# EAGLE design IO-module-8x_fused_in-wall_35x25 (EAGLE 9.6.2)
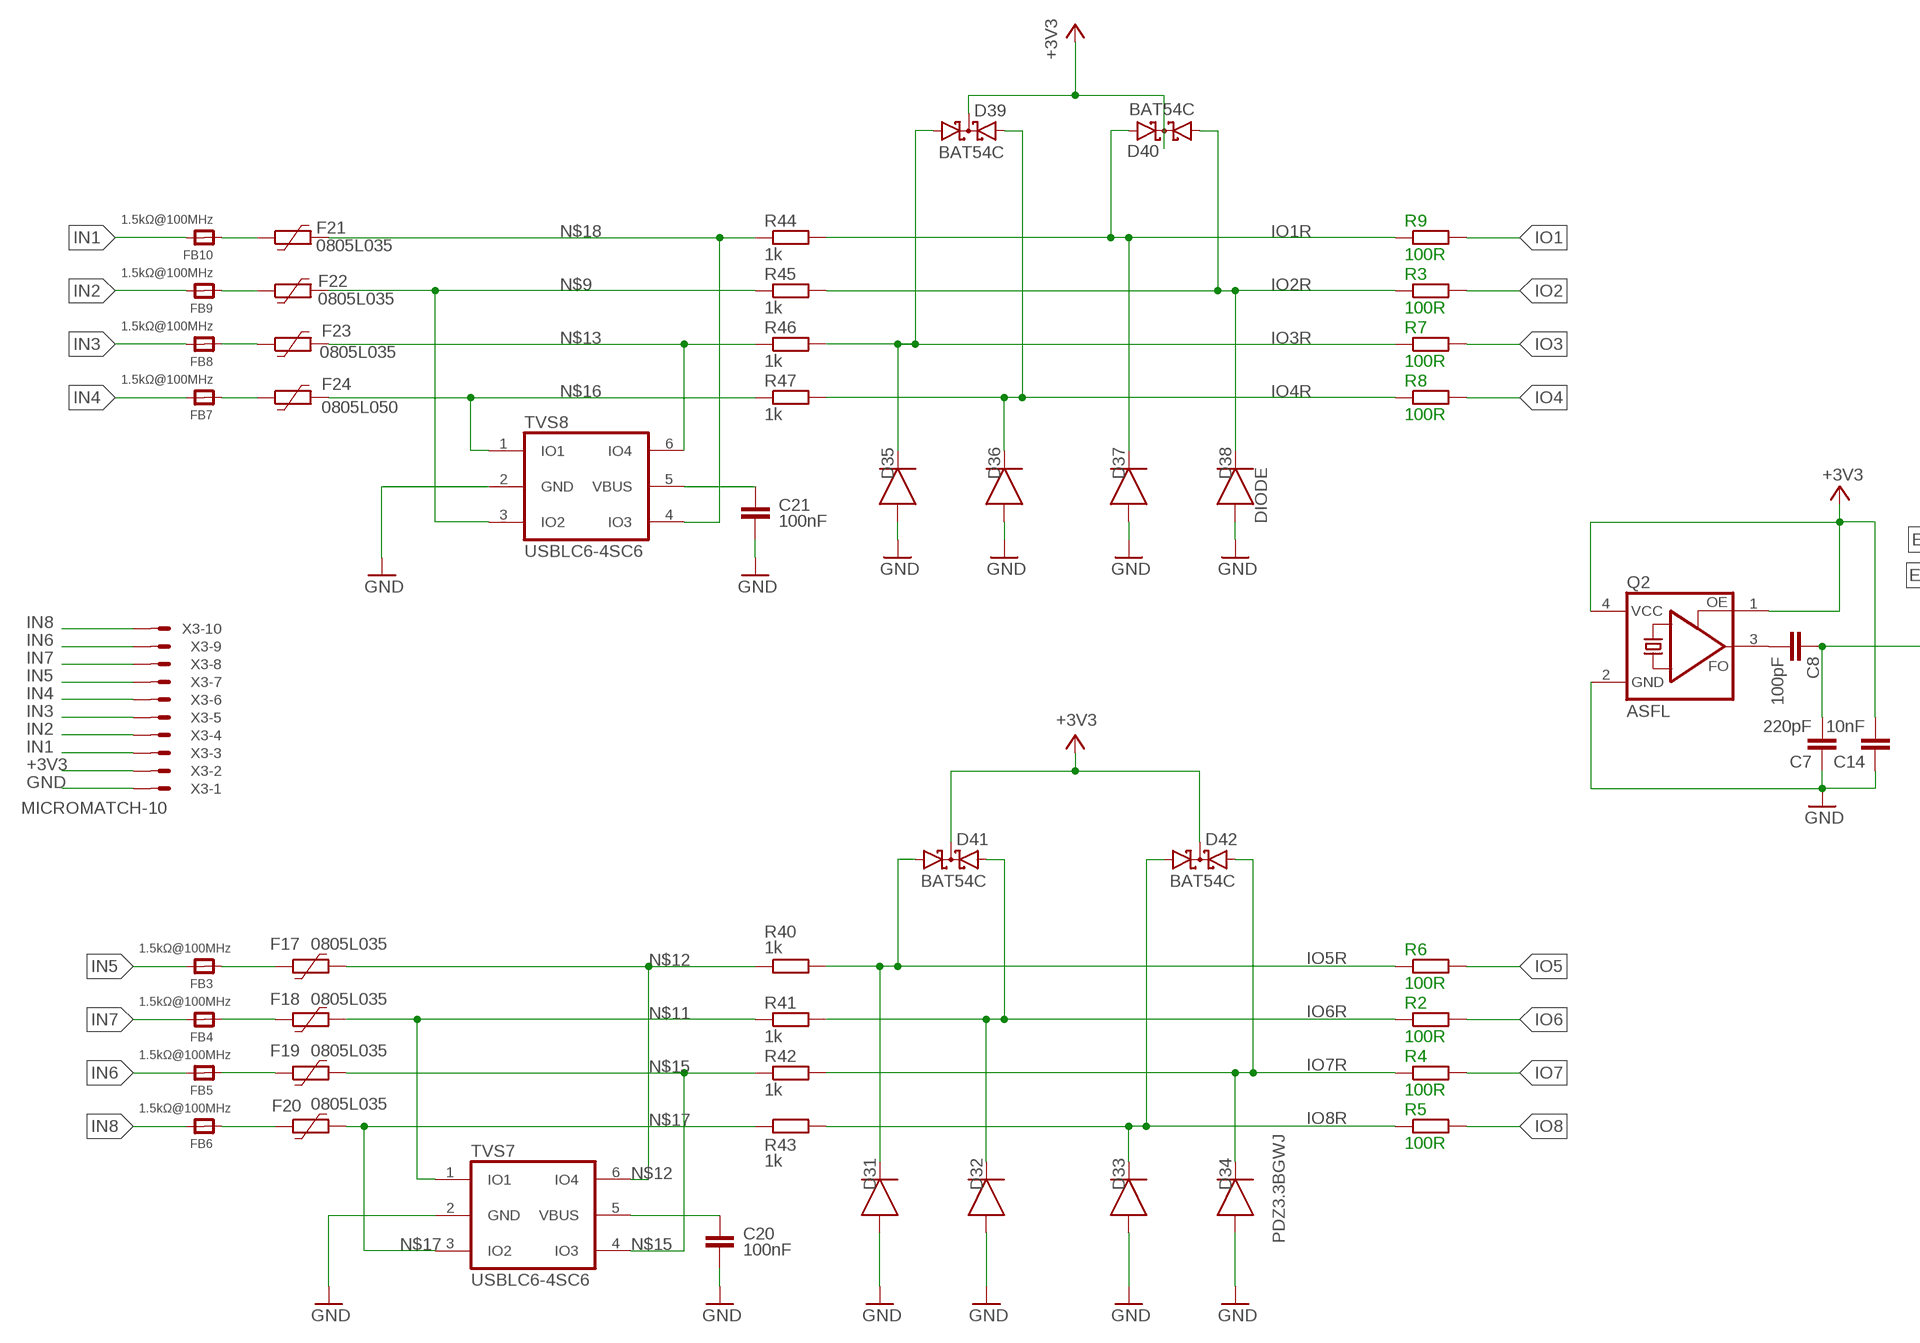
[diagram p0: schematic, sheet 1, part 1 of 2]
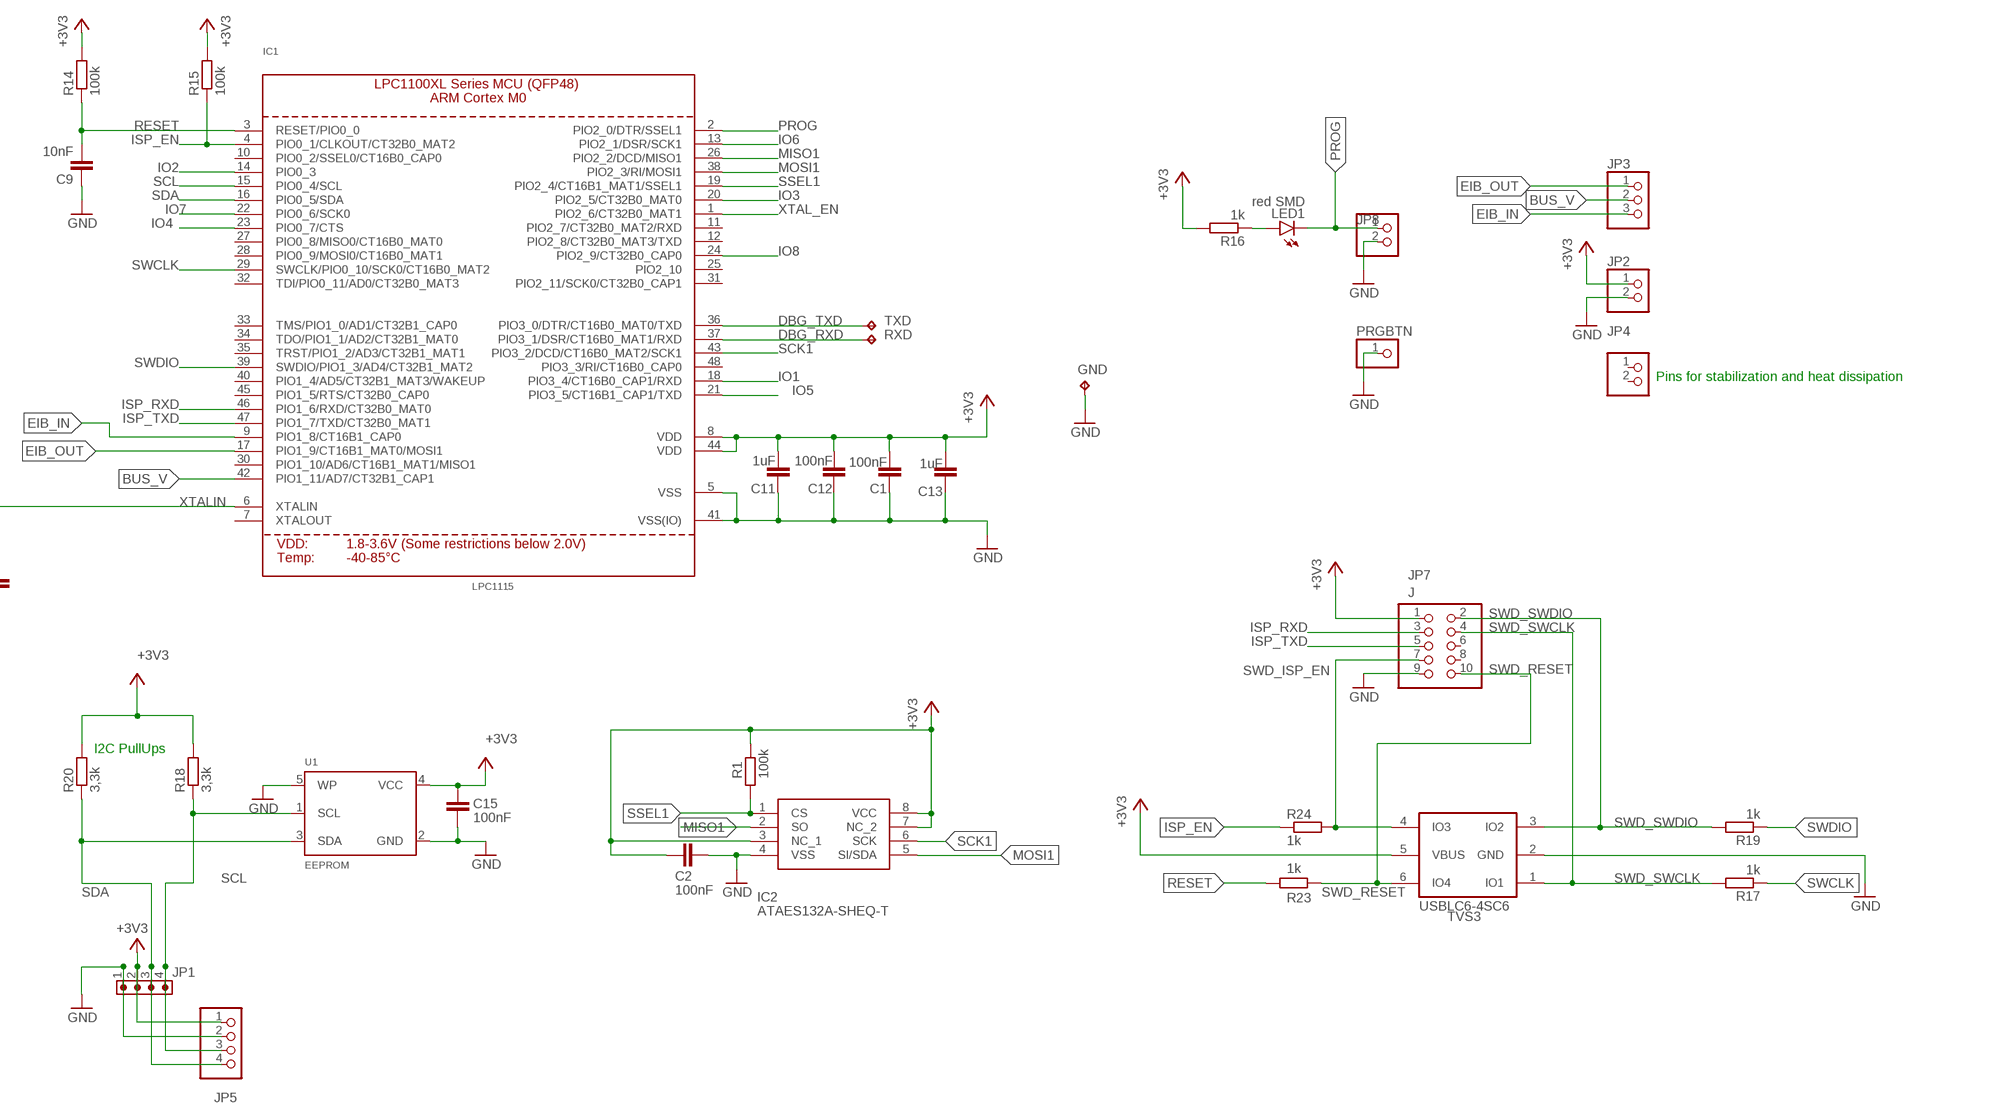
[diagram p1: schematic, sheet 1, part 2 of 2]

## Parts
C1  100nF  C-EUC0805  [C0805]
C2  100nF  C-EUC0805  [C0805]
C7  220pF  C-EUC0805  [C0805]
C8  100pF  C-EUC0805  [C0805]
C9  10nF  C-EUC0805  [C0805]
C11  1uF  C-EUC0805  [C0805]
C12  100nF  C-EUC0805  [C0805]
C13  1uF  C-EUC0805  [C0805]
C14  10nF  C-EUC0805  [C0805]
C15  100nF  C-EUC0805  [C0805]
C20  100nF  C-EUC0805  [C0805]
C21  100nF  C-EUC0805  [C0805]
D31  DDZ9684  DIODE_DO-219-AB(SOD123F)  [SODFL3718X115]
D32  DIODE  DIODE_DO-219-AB(SOD123F)  [SODFL3718X115]
D33  DIODE  DIODE_DO-219-AB(SOD123F)  [SODFL3718X115]
D34  PDZ3.3BGWJ  DIODE_DO-219-AB(SOD123F)  [SODFL3718X115]
D35  DIODE  DIODE_DO-219-AB(SOD123F)  [SODFL3718X115]
D36  DIODE  DIODE_DO-219-AB(SOD123F)  [SODFL3718X115]
D37  DIODE  DIODE_DO-219-AB(SOD123F)  [SODFL3718X115]
D38  DIODE  DIODE_DO-219-AB(SOD123F)  [SODFL3718X115]
D39  BAT54C  [SOT23]
D40  BAT54C  [SOT23]
D41  BAT54C  [SOT23]
D42  BAT54C  [SOT23]
F17  0805L035  [0805L]
F18  0805L035  [0805L]
F19  0805L035  [0805L]
F20  0805L035  [0805L]
F21  0805L035  [0805L]
F22  0805L035  [0805L]
F23  0805L035  [0805L]
F24  0805L050  [0805L]
FB3  1.5kΩ@100MHz  FERRITE0805  [0805]
FB4  1.5kΩ@100MHz  FERRITE0805  [0805]
FB5  1.5kΩ@100MHz  FERRITE0805  [0805]
FB6  1.5kΩ@100MHz  FERRITE0805  [0805]
FB7  1.5kΩ@100MHz  FERRITE0805  [0805]
FB8  1.5kΩ@100MHz  FERRITE0805  [0805]
FB9  1.5kΩ@100MHz  FERRITE0805  [0805]
FB10  1.5kΩ@100MHz  FERRITE0805  [0805]
GND  TPTP11SQ  [TP11SQ]
IC1  LPC1115  LPC1113/4/5_QFP48_XLSERIES  [LQFP48]
IC2  ATAES132A-SHEQ-T  [SOIC127P600X175-8N]
JP1  62000411622  62000411622  [62000411622]
JP2  PINHD-1X2  [1X02]
JP3  PINHD-1X3  [1X03]
JP4  PINHD-1X2  [1X02]
JP5  PINHD-1X4  [1X04]
JP7  J  PINHD-2X05_2.00  [2X05M]
JP8  PINHD-1X2  [1X02]
LED1  red SMD  LEDCHIPLED_1206  [CHIPLED_1206]
PRGBTN  PINHD-1X1  [1X01]
Q2  ASFL  [ASF]
R1  100k  R-EU_R0805  [R0805]
R2  100R  R-EU_R0805  [R0805]
R3  100R  R-EU_R0805  [R0805]
R4  100R  R-EU_R0805  [R0805]
R5  100R  R-EU_R0805  [R0805]
R6  100R  R-EU_R0805  [R0805]
R7  100R  R-EU_R0805  [R0805]
R8  100R  R-EU_R0805  [R0805]
R9  100R  R-EU_R0805  [R0805]
R14  100k  R-EU_R0805  [R0805]
R15  100k  R-EU_R0805  [R0805]
R16  1k  R-EU_R0805  [R0805]
R17  1k  R-EU_R0805  [R0805]
R18  3,3k  R-EU_R0805  [R0805]
R19  1k  R-EU_R0805  [R0805]
R20  3,3k  R-EU_R0805  [R0805]
R23  1k  R-EU_R0805  [R0805]
R24  1k  R-EU_R0805  [R0805]
R40  1k  R-EU_R0805  [R0805]
R41  1k  R-EU_R0805  [R0805]
R42  1k  R-EU_R0805  [R0805]
R43  1k  R-EU_R0805  [R0805]
R44  1k  R-EU_R0805  [R0805]
R45  1k  R-EU_R0805  [R0805]
R46  1k  R-EU_R0805  [R0805]
R47  1k  R-EU_R0805  [R0805]
RXD  TPTP12R  [TP12R]
TVS3  USBLC6-4SC6  [SOT-23-6L]
TVS7  USBLC6-4SC6  [SOT-23-6L]
TVS8  USBLC6-4SC6  [SOT-23-6L]
TXD  TPTP12SQ  [TP12SQ]
U1  EEPROM  EEPROM_I2C_MCP24AA32  [SOT23-5]
X3  MICROMATCH-10  [MICROMATCH-10]

## Nets
+3V3: C1.2 C2.1 C11.2 C12.2 C13.2 C14.2 C15.1 D39.3(CC) D40.3(CC) D41.3(CC) D42.3(CC) IC1.8(VDD) IC1.44(VDD) IC2.3(NC_1) IC2.7(NC_2) IC2.8(VCC) JP1.2 JP2.1 JP5.1 JP7.1 Q2.1(OE) Q2.4(VCC) R1.2 R14.2 R15.2 R16.2 R18.2 R20.2 TVS3.5(VBUS) U1.4(VCC) X3.2
BUS_V: IC1.42(PIO1_11/AD7/CT32B1_CAP1) JP3.2
DBG_RXD: IC1.37(PIO3_1/DSR/CT16B0_MAT1/RXD) RXD.TP
DBG_TXD: IC1.36(PIO3_0/DTR/CT16B0_MAT0/TXD) TXD.TP
EIB_IN: IC1.9(PIO1_8/CT16B1_CAP0) JP3.3
EIB_OUT: IC1.17(PIO1_9/CT16B1_MAT0/MOSI1) JP3.1
GND: C1.1 C2.2 C7.1 C9.1 C11.1 C12.1 C13.1 C14.1 C15.2 C20.1 C21.1 D31.2(A) D32.2(A) D33.2(A) D34.2(A) D35.2(A) D36.2(A) D37.2(A) D38.2(A) GND.TP IC1.5(VSS) IC1.41(VSS(IO)) IC2.4(VSS) JP1.1 JP2.2 JP5.2 JP7.9 JP8.2 PRGBTN.1 Q2.2(GND) TVS3.2(GND) TVS7.2(GND) TVS8.2(GND) U1.2(GND) U1.5(WP) X3.1
IN1: FB10.2 X3.3
IN2: FB9.2 X3.4
IN3: FB8.2 X3.5
IN4: FB7.2 X3.6
IN5: FB3.2 X3.7
IN6: FB5.2 X3.9
IN7: FB4.2 X3.8
IN8: FB6.2 X3.10
IO1: IC1.18(PIO3_4/CT16B0_CAP1/RXD) R9.2
IO1R: D37.1(C) D40.2(A2) R9.1 R44.2
IO2: IC1.14(PIO0_3) R3.2
IO2R: D38.1(C) D40.1(A1) R3.1 R45.2
IO3: IC1.20(PIO2_5/CT32B0_MAT0) R7.2
IO3R: D35.1(C) D39.1(A1) R7.1 R46.2
IO4: IC1.23(PIO0_7/CTS) R8.2
IO4R: D36.1(C) D39.2(A2) R8.1 R47.2
IO5: IC1.21(PIO3_5/CT16B1_CAP1/TXD) R6.2
IO5R: D31.1(C) D41.1(A1) R6.1 R40.2
IO6: IC1.13(PIO2_1/DSR/SCK1) R2.2
IO6R: D32.1(C) D41.2(A2) R2.1 R41.2
IO7: IC1.22(PIO0_6/SCK0) R4.2
IO7R: D34.1(C) D42.2(A2) R4.1 R42.2
IO8: IC1.24(PIO2_9/CT32B0_CAP0) R5.2
IO8R: D33.1(C) D42.1(A1) R5.1 R43.2
ISP_EN: IC1.4(PIO0_1/CLKOUT/CT32B0_MAT2) R15.1 R24.1
ISP_RXD: IC1.46(PIO1_6/RXD/CT32B0_MAT0) JP7.3
ISP_TXD: IC1.47(PIO1_7/TXD/CT32B0_MAT1) JP7.5
MISO1: IC1.26(PIO2_2/DCD/MISO1) IC2.2(SO)
MOSI1: IC1.38(PIO2_3/RI/MOSI1) IC2.5(SI/SDA)
N$1: F19.1 FB5.1
N$2: F20.1 FB6.1
N$3: F18.1 FB4.1
N$4: F17.1 FB3.1
N$5: F24.1 FB7.1
N$6: F23.1 FB8.1
N$7: F21.1 FB10.1
N$8: F22.1 FB9.1
N$9: F22.2 R45.1 TVS8.3(IO2)
N$10: C8.2 Q2.3(FO)
N$11: F18.2 R41.1 TVS7.1(IO1)
N$12: F17.2 R40.1 TVS7.6(IO4)
N$13: F23.2 R46.1 TVS8.6(IO4)
N$15: F19.2 R42.1 TVS7.4(IO3)
N$16: F24.2 R47.1 TVS8.1(IO1)
N$17: F20.2 R43.1 TVS7.3(IO2)
N$18: F21.2 R44.1 TVS8.4(IO3)
N$41: LED1.A R16.1
N$43: C20.2 TVS7.5(VBUS)
N$48: C21.2 TVS8.5(VBUS)
PROG: IC1.2(PIO2_0/DTR/SSEL1) JP8.1 LED1.C
RESET: C9.2 IC1.3(RESET/PIO0_0) R14.1 R23.2
SCK1: IC1.43(PIO3_2/DCD/CT16B0_MAT2/SCK1) IC2.6(SCK)
SCL: IC1.15(PIO0_4/SCL) JP1.4 JP5.3 R18.1 U1.1(SCL)
SDA: IC1.16(PIO0_5/SDA) JP1.3 JP5.4 R20.1 U1.3(SDA)
SSEL1: IC1.19(PIO2_4/CT16B1_MAT1/SSEL1) IC2.1(CS) R1.1
SWCLK: IC1.29(SWCLK/PIO0_10/SCK0/CT16B0_MAT2) R17.1
SWD_ISP_EN: JP7.7 R24.2 TVS3.4(IO3)
SWD_RESET: JP7.10 R23.1 TVS3.6(IO4)
SWD_SWCLK: JP7.4 R17.2 TVS3.1(IO1)
SWD_SWDIO: JP7.2 R19.2 TVS3.3(IO2)
SWDIO: IC1.39(SWDIO/PIO1_3/AD4/CT32B1_MAT2) R19.1
XTAL_EN: IC1.1(PIO2_6/CT32B0_MAT1)
XTALIN: C7.2 C8.1 IC1.6(XTALIN)
Unconnected: IC1.7(XTALOUT) IC1.10(PIO0_2/SSEL0/CT16B0_CAP0) IC1.11(PIO2_7/CT32B0_MAT2/RXD) IC1.12(PIO2_8/CT32B0_MAT3/TXD) IC1.25(PIO2_10) IC1.27(PIO0_8/MISO0/CT16B0_MAT0) IC1.28(PIO0_9/MOSI0/CT16B0_MAT1) IC1.30(PIO1_10/AD6/CT16B1_MAT1/MISO1) IC1.31(PIO2_11/SCK0/CT32B0_CAP1) IC1.32(TDI/PIO0_11/AD0/CT32B0_MAT3) IC1.33(TMS/PIO1_0/AD1/CT32B1_CAP0) IC1.34(TDO/PIO1_1/AD2/CT32B1_MAT0) IC1.35(TRST/PIO1_2/AD3/CT32B1_MAT1) IC1.40(PIO1_4/AD5/CT32B1_MAT3/WAKEUP) IC1.45(PIO1_5/RTS/CT32B0_CAP0) IC1.48(PIO3_3/RI/CT16B0_CAP0) JP4.1 JP4.2 JP7.6 JP7.8

## Notes on the sheet
- Pins for stabilization and heat dissipation
- I2C PullUps

## Library data of the parts
C1 C9 C11 = rcl:C-EU: CAPACITOR, European symbol; REICHELT: X7R-G0805 10N; SPICEPREFIX: C
C2 C12 C13 C15 = rcl:C-EU: CAPACITOR, European symbol; REICHELT: X7R-G0805 100N; SPICEPREFIX: C
C7 C8 C14 C20 C21 = rcl:C-EU: CAPACITOR, European symbol; SPICEPREFIX: C
D31 D34 = Diode:DIODE: Diode Rectifier - Generic; CATEGORY: Diode; SUB-CATEGORY: Rectifier; VALUE: DIODE
D32 D33 D35-D38 = Diode:DIODE: Diode Rectifier - Generic; CATEGORY: Diode; SUB-CATEGORY: Rectifier
D39-D42 = diode:BAT54C: Schottky Diodes Source: Fairchild .. BAT54.pdf
F17-F23 = polyfuse-smd_10:?: Polyfuse Resettable PTC Source: http://www.littelfuse.com/products/resettable-ptcs.aspx; MF: Littelfuse; MPN: 0805L035; OC_FARNELL: 1832102RL; OC_NEWARK: 18M4775
F24 = polyfuse-smd_10:?: Polyfuse Resettable PTC Source: http://www.littelfuse.com/products/resettable-ptcs.aspx; MF: Littelfuse; MPN: 0805L050; OC_FARNELL: 1832103; OC_NEWARK: 18M4776
FB3-FB10 = microbuilder:FERRITE: Ferrite Bead 0603 MMZ1608B121C - 120 Ohm @ 100MHz, 600mA, 0.15 Ohm DC Resistance - Digikey: 445-2164-1-ND BK1608HW121-T - 120 Ohm, 600mA Ferrite Chip - Digikey: 587-1876-2-ND 0805 HZ0805B272R-10 - 2.7K Ohm @ 100MHz, 200mA, 0.8 Ohm DC Resistance - Digikey: 240-2504-1-ND (see also Murata BLM21BD272SN1L) MMZ2012Y152B - 1.5K Ohm @ 100MHz, 500mA, 0.4 Ohm DC Resistance - Digikey: 445-1560-1-ND - Mainly for high frequency (80-400MHz) MMZ2012R102A - 1K Ohm @ 100MHz, 500mA, 0.3 Ohm DC Resistance - Digikey: 445-1555-2-ND - More general purpose (10-200MHz)
GND RXD TXD = testpad:TP: Test pad
IC1 = microbuilder:LPC1113/4/5_QFP48_XLSERIES: LPC1113/4/5 ARM Cortex M0 MCU (50MHz) - XL Series (FBD48/3x3) LPC1115FBD48/303: Max Frequency: 50MHz Flash: 64kB SRAM: 8kB ADC: 10-bit
IC2 = SamacSys_Parts:ATAES132A-SHEQ-T: Security ICs / Authentication ICs 32Kbit AES Auth SPI soic(S), GR Source: Datasheet <http://www.microchip.com/mymicrochip/filehandler.aspx?ddocname=en590569>; DESCRIPTION: Security ICs / Authentication ICs 32Kbit AES Auth SPI soic(S), GR; HEIGHT: 1.75mm; MANUFACTURER_NAME: Microchip; MANUFACTURER_PART_NUMBER: ATAES132A-SHEQ-T; MOUSER_PART_NUMBER: 556-ATAES132A-SHEQ-T; MOUSER_PRICE-STOCK: https://www.mouser.co.uk/ProductDetail/Microchip-Technology-Atmel/ATAES132A-SHEQ-T?qs=9KdFJXLqUo%252BeCVGZWjCBZQ%3D%3D
JP1 = Eagle_WR-WTB (rev22a):62000411622: WR-WTB 2.00 mm Male Vertical Shrouded Header KIND PROPERTIES: Pitch 2 mm Gender Male Type Vertical MATERIAL PROPERTIES: Insulator Material LCP Insulator Flammability Rating UL94 V-0 Insulator Color Beige; White Contact Material Copper Alloy Contact Plating Tin Contact Type Stamped GENERAL INFORMATION Operating Temperature -25 up to +85 °C IR 2 A Working Voltage 125 V (AC) Withstanding Voltage 800 V (AC) Contact Resistance 20 mΩ RISO 1000 MΩ CERTIFICATION UL Approval E323964 PACKAGING PROPERTIES Packaging Bag <https://www.we-online.com/catalog/media/o33351v209%20Family_WR-WTB_6200xx11622.jpg> Details see: www.we-online.com/catalog/WTB_2_00_MALE_VERTICAL_SHROUDED_HEADER_6200XX11622 <www.we-online.com/catalog/WTB_2_00_MALE_VERTICAL_SHROUDED_HEADER_6200XX11622/?utm_source=eagle_model&utm_medium=description_link&utm_campaign=eisos_eagle> Updated by Ella Wu 2022-07-27 2022 (C) Würth Elektronik; CONTACT-RESISTANCE: 20mOhm; DATASHEET-URL: https://www.we-online.com/redexpert/spec/62000411622?ae; GENDER: Male; IR: 2A; L: 10mm; MOUNT: THT; PACKAGING: Bag; PART-NUMBER: 62000411622; PCB-CABLE-PANEL: PCB; PINS: 4; PITCH: 2mm; TYPE: Vertical; WORKING-VOLTAGE: 125V(AC)
JP2 JP4 JP8 = pinhead_dmx:PINHD-1X2: PIN HEADER
JP3 = pinhead_dmx:PINHD-1X3: PIN HEADER
JP5 = pinhead_dmx:PINHD-1X4: PIN HEADER
JP7 = pinhead-2:PINHD-2X05: PIN HEADER; REICHELT: MPE 150-3-010
LED1 = led:LED: LED OSRAM: - CHIPLED LG R971, LG N971, LY N971, LG Q971, LY Q971, LO R971, LY R971 LH N974, LH R974 LS Q976, LO Q976, LY Q976 LO Q996 - Hyper CHIPLED LW Q18S LB Q993, LB Q99A, LB R99A - SideLED LS A670, LO A670, LY A670, LG A670, LP A670 LB A673, LV A673, LT A673, LW A673 LH A674 LY A675 LS A676, LA A676, LO A676, LY A676, LW A676 LS A679, LY A679, LG A679 - Hyper Micro SIDELED® LS Y876, LA Y876, LO Y876, LY Y876 LT Y87S - SmartLED LW L88C, LW L88S LB L89C, LB L89S, LG L890 LS L89K, LO L89K, LY L89K LS L896, LA L896, LO L896, LY L896 - TOPLED LS T670, LO T670, LY T670, LG T670, LP T670 LSG T670, LSP T670, LSY T670, LOP T670, LYG T670 LG T671, LOG T671, LSG T671 LB T673, LV T673, LT T673, LW T673 LH T674 LS T676, LA T676, LO T676, LY T676, LB T676, LH T676, LSB T676, LW T676 LB T67C, LV T67C, LT T67C, LS T67K, LO T67K, LY T67K, LW E67C LS E67B, LA E67B, LO E67B, LY E67B, LB E67C, LV E67C, LT E67C LW T67C LS T679, LY T679, LG T679 LS T770, LO T770, LY T770, LG T770, LP T770 LB T773, LV T773, LT T773, LW T773 LH T774 LS E675, LA E675, LY E675, LS T675 LS T776, LA T776, LO T776, LY T776, LB T776 LHGB T686 LT T68C, LB T68C - Hyper Mini TOPLED® LB M676 - Mini TOPLED Santana® LG M470 LS M47K, LO M47K, LY M47K Source: http://www.osram.convergy.de LUXEON: - LUMILED® LXK2-PW12-R00, LXK2-PW12-S00, LXK2-PW14-U00, LXK2-PW14-V00 LXK2-PM12-R00, LXK2-PM12-S00, LXK2-PM14-U00 LXK2-PE12-Q00, LXK2-PE12-R00, LXK2-PE12-S00, LXK2-PE14-T00, LXK2-PE14-U00 LXK2-PB12-K00, LXK2-PB12-L00, LXK2-PB12-M00, LXK2-PB14-N00, LXK2-PB14-P00, LXK2-PB14-Q00 LXK2-PR12-L00, LXK2-PR12-M00, LXK2-PR14-Q00, LXK2-PR14-R00 LXK2-PD12-Q00, LXK2-PD12-R00, LXK2-PD12-S00 LXK2-PH12-R00, LXK2-PH12-S00 LXK2-PL12-P00, LXK2-PL12-Q00, LXK2-PL12-R00 Source: www.luxeon.com KINGBRIGHT: KA-3528ASYC Source: www.kingbright.com; REICHELT: SMD-LED 0805 RT
PRGBTN = pinhead_dmx:PINHD-1X1: PIN HEADER
Q2 = crystal:ASF*: CRYSTAL CLOCK OSCILLATORS 5.0 Vdc or 3.3 Vdc - LOW PROFILE ULTRA MINIATURE CERAMIC SURFACE MOUNT Source: http://www.abracon.com/Oscillators/asf1-L-L1.pdf; MPN: ASFLM1-50.000MHZ-C-T; OC_FARNELL: 1838931; OC_NEWARK: 99M0411
R1 R18 R20 = rcl:R-EU_: RESISTOR, European symbol; REICHELT: SMD-0805 3,30K; SPICEPREFIX: R
R2-R9 R17 R19 R23 R24 R40-R47 = rcl:R-EU_: RESISTOR, European symbol; SPICEPREFIX: R
R14 R15 = rcl:R-EU_: RESISTOR, European symbol; REICHELT: SMD-0805 100K; SPICEPREFIX: R
R16 = rcl:R-EU_: RESISTOR, European symbol; REICHELT: SMD-0805 1,00K; SPICEPREFIX: R
TVS3 TVS7 TVS8 = usblc6:USBLC6-4: Very low capacitance ESD protection 4 line Features 4 data-line protection Protects V BUS Very low capacitance: 3 pF Very low leakage current: 10 nA Peak pulse power (8/20 μs): 130 W typ. SOT23-6L package RoHS compliant Datasheet <https://www.st.com/resource/en/datasheet/usblc6-4.pdf>
U1 = microbuilder:EEPROM_I2C_MCP24AA32: Microchip 32K (4K x 8) 1.8V I2C EEPROM SOT23-5 [Digikey: 24AA32AFT-I/OTCT-ND]
X3 = con-amp-micromatch:MICROMATCH-10: MicroMaTch 10 8-215464-0 / 1-215464-0 Drawing Number C-215464 DDEController.pdf; MF: FARNELL; MPN: 8-215464-0; OC_FARNELL: 3784654; OC_NEWARK: 19J6430

## Board
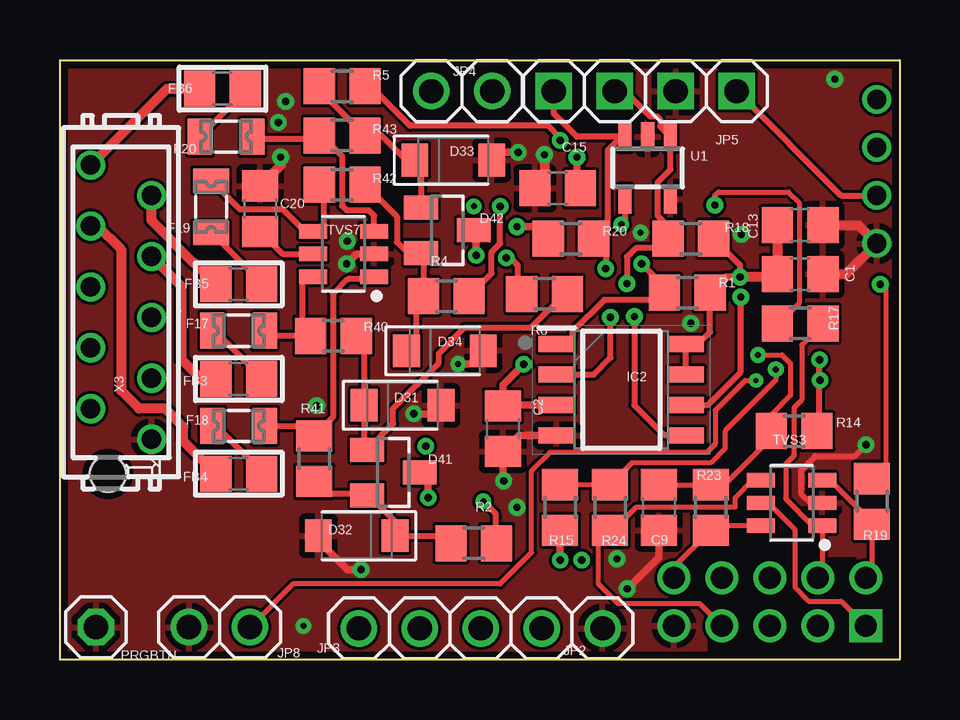
[diagram p2: board, top side]
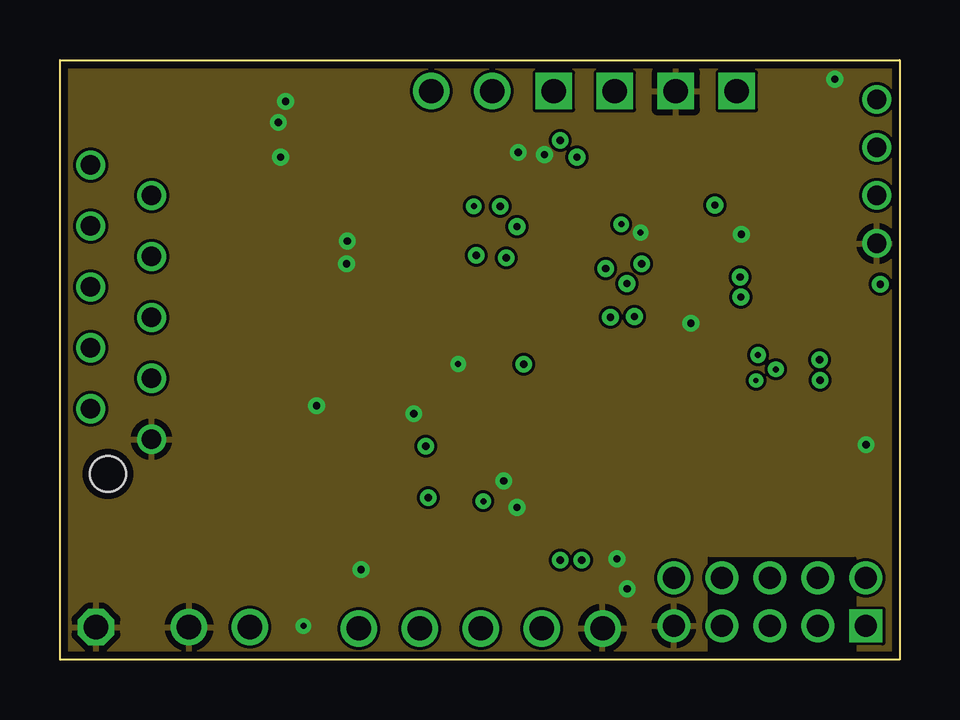
[diagram p3: board, inner layer GND]
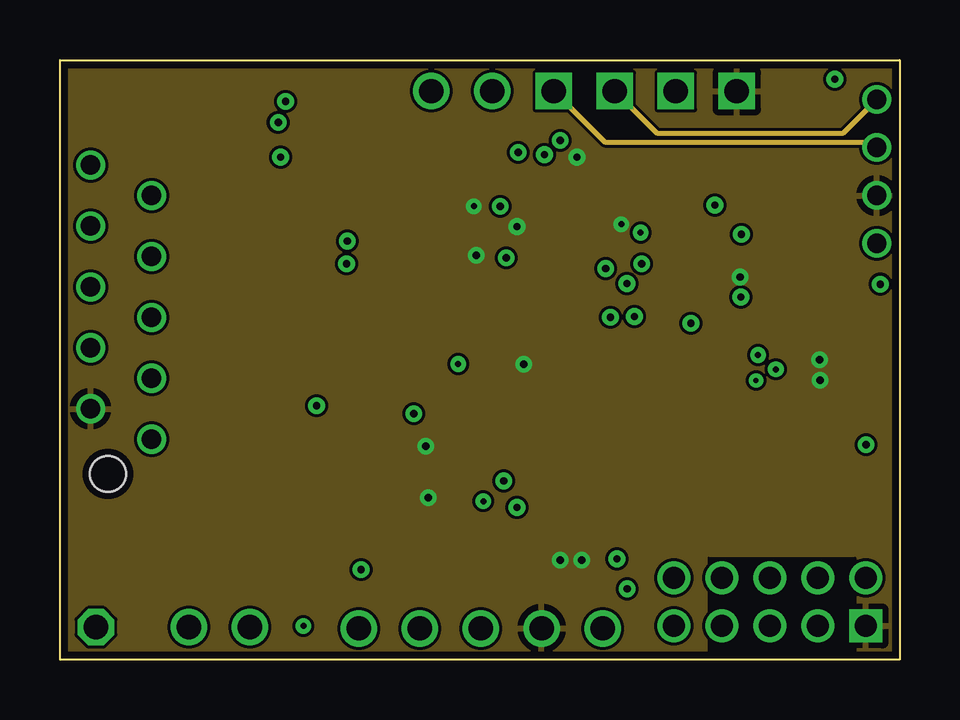
[diagram p4: board, inner layer VCC]
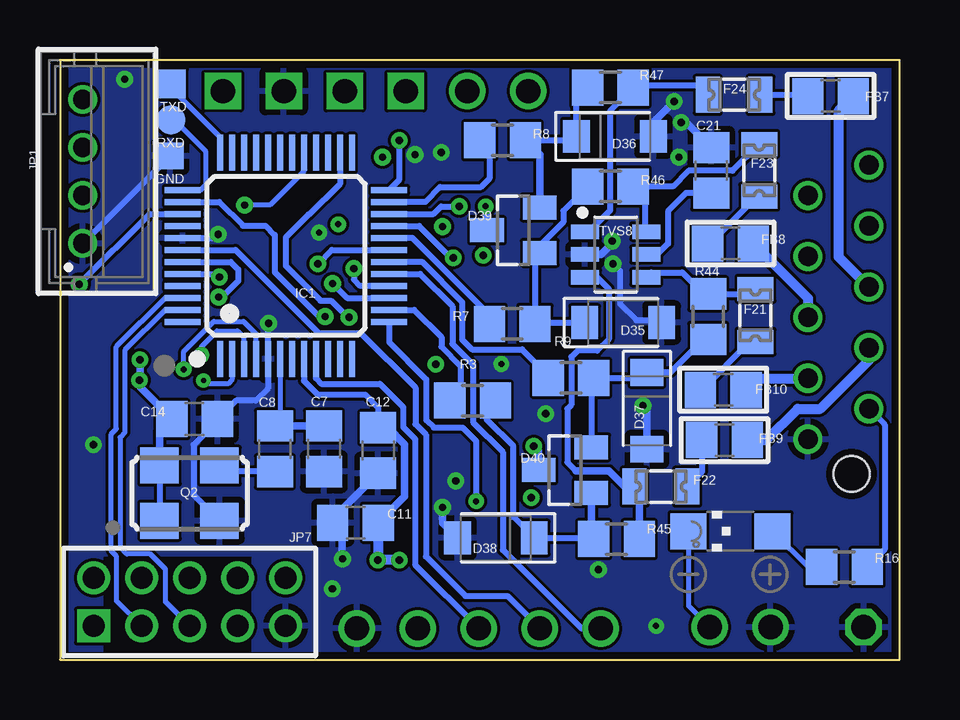
[diagram p5: board, bottom side, seen from below]

Size 35 x 25 mm. Coordinates in mm from the lower left corner, seen from the top.
Outline: 35,0 0,0 0,25 35,25 35,0
Copper layers (1+2*15+16): Top 0.035mm / dielectric 0.2mm / GND 0.018mm / dielectric 1.5mm / VCC 0.018mm / dielectric 0.2mm / Bottom 0.035mm
Design rules "aisler_4_layer_complex *": minimum track width 0.125mm, minimum drill 0.2mm, track to track 0.125mm, track to pad 0.125mm, pad to pad 0.125mm, via to via 0.125mm, smd to smd 0.125mm, copper to edge 0.3mm, drill to drill 0.25mm, minimum pad ring 0.2mm, minimum via ring 0.2mm, stop-mask expansion 0mil, vias tented up to drill 0mil, thermal gap 10mil

### Footprints (pad centres in the part's own frame; a part is rotated, then mirrored left to right if it is on the bottom)
C0805 = smd 1.3 x 1.5: 1 -0.95,0; 2 0.95,0
SODFL3718X115 = smd 1.115 x 1.361: 1 -1.6,0; 2 1.6,0
SOT23 = smd 1 x 1.4: 1 -0.95,-1.1; 2 0.95,-1.1; 3 0,1.1
0805L = smd 1 x 1.5: 1 -1.1,0; 2 1.1,0
0805 = smd 1.3 x 1.5: 1 -0.95,0; 2 0.95,0
TP11SQ = smd 1.1 x 1.1: TP 0,0
LQFP48 = smd 1.5 x 0.25: 1 -4.3,2.75; 2 -4.3,2.25; 3 -4.3,1.75; 4 -4.3,1.25; 5 -4.3,0.75; 6 -4.3,0.25; 7 -4.3,-0.25; 8 -4.3,-0.75; 9 -4.3,-1.25; 10 -4.3,-1.75; 11 -4.3,-2.25; 12 -4.3,-2.75; 25 4.3,-2.75; 26 4.3,-2.25; 27 4.3,-1.75; 28 4.3,-1.25; 29 4.3,-0.75; 30 4.3,-0.25; 31 4.3,0.25; 32 4.3,0.75; 33 4.3,1.25; 34 4.3,1.75; 35 4.3,2.25; 36 4.3,2.75 | smd 0.25 x 1.5: 13 -2.75,-4.3; 14 -2.25,-4.3; 15 -1.75,-4.3; 16 -1.25,-4.3; 17 -0.75,-4.3; 18 -0.25,-4.3; 19 0.25,-4.3; 20 0.75,-4.3; 21 1.25,-4.3; 22 1.75,-4.3; 23 2.25,-4.3; 24 2.75,-4.3; 37 2.75,4.3; 38 2.25,4.3; 39 1.75,4.3; 40 1.25,4.3; 41 0.75,4.3; 42 0.25,4.3; 43 -0.25,4.3; 44 -0.75,4.3; 45 -1.25,4.3; 46 -1.75,4.3; 47 -2.25,4.3; 48 -2.75,4.3
SOIC127P600X175-8N = smd 1.5 x 0.65: 1 -2.7,1.905; 2 -2.7,0.635; 3 -2.7,-0.635; 4 -2.7,-1.905; 5 2.7,-1.905; 6 2.7,-0.635; 7 2.7,0.635; 8 2.7,1.905
62000411622 = drill 0.8: 1 3,-0.6; 2 1,-0.6; 3 -1,-0.6; 4 -3,-0.6
1X02 = drill 1.016: 1 -1.27,0; 2 1.27,0
1X03 = drill 1.016: 1 -2.54,0; 2 0,0; 3 2.54,0
1X04 = drill 1.016 square: 1 -3.81,0; 2 -1.27,0; 3 1.27,0; 4 3.81,0
2X05M = drill 0.914 square: 1 -4,-1 | drill 0.914: 2 -4,1; 3 -2,-1; 4 -2,1; 5 0,-1; 6 0,1; 7 2,-1; 8 2,1; 9 4,-1; 10 4,1
CHIPLED_1206 = smd 1.5 x 1.5: A 0,-1.75; C 0,1.75
1X01 = drill 1.016 octagon: 1 0,0
ASF = smd 1.6 x 1.5: 1 -1.25,-1.15; 2 1.25,-1.15; 3 1.25,1.15; 4 -1.25,1.15
R0805 = smd 1.3 x 1.5: 1 -0.95,0; 2 0.95,0
TP12R = smd 1.2 x 1.2: TP 0,0
SOT-23-6L = smd 1.165 x 0.597: 1 -1.275,0.95; 2 -1.275,0; 3 -1.275,-0.95; 4 1.275,-0.95; 5 1.275,0; 6 1.275,0.95
TP12SQ = smd 1.2 x 1.2: TP 0,0
SOT23-5 = smd 0.55 x 1.2: 1 -0.95,-1.3; 2 0,-1.3; 3 0.95,-1.3; 4 0.95,1.3; 5 -0.95,1.3
MICROMATCH-10 = drill 0.813: 1 5.715,1.27; 2 4.445,-1.27; 3 3.175,1.27; 4 1.905,-1.27; 5 0.635,1.27; 6 -0.635,-1.27; 7 -1.905,1.27; 8 -3.175,-1.27; 9 -4.445,1.27; 10 -5.715,-1.27 | hole 1.5: 7.16,-0.55

### Placement (x,y rotation side)
C1  30.86,16.07 180 top
C2  18.46,9.62 270 top
C7  23.99,8.79 90 bottom
C8  26.04,8.79 270 bottom
C9  24.97,6.34 90 top
C11  22.68,5.71 0 bottom
C12  21.73,8.72 90 bottom
C13  30.86,18.11 180 top
C14  29.39,10.03 180 bottom
C15  20.75,19.65 180 top
C20  8.35,18.8 270 top
C21  7.85,20.4 270 bottom
D31  14.28,10.6 0 top
D32  12.37,5.16 180 top
D33  16.39,20.82 0 top
D34  16.05,12.88 0 top
D35  11.52,14.05 0 bottom
D36  11.86,21.81 0 bottom
D37  10.53,10.37 270 bottom
D38  16.83,5.07 180 bottom
D39  16.1,17.9 90 bottom
D40  13.95,7.9 90 bottom
D41  13.9,7.8 270 top
D42  16.15,17.9 270 top
F17  7.45,13.71 0 top
F18  7.45,9.74 0 top
F19  6.3,18.88 90 top
F20  6.92,21.8 0 top
F21  6.01,14.35 90 bottom
F22  9.95,7.21 180 bottom
F23  5.85,20.39 90 bottom
F24  6.89,23.55 180 bottom
FB3  7.45,11.7 180 top
FB4  7.45,7.75 180 top
FB5  7.45,15.65 180 top
FB6  6.78,23.8 180 top
FB7  2.88,23.5 0 bottom
FB8  7.05,17.35 0 bottom
FB9  7.3,9.15 0 bottom
FB10  7.35,11.25 0 bottom
GND  30.4,21 0 bottom
IC1  25.58,16.83 90 bottom
IC2  23.4,11.25 0 top
JP1  33.45,20.35 270 bottom
JP2  21.35,1.3 0 top
JP3  15,1.3 0 top
JP4  16.75,23.7 180 top
JP5  24.4,23.7 180 top
JP7  29.6,2.4 0 bottom
JP8  6.65,1.35 180 top
LED1  7.05,5.35 90 bottom
PRGBTN  1.5,1.35 0 top
Q2  29.6,6.94 0 bottom
R1  26.15,15.3 0 top
R2  17.25,4.85 0 top
R3  17.8,10.8 180 bottom
R4  16.1,15.15 0 top
R5  11.76,23.9 0 top
R6  20.2,15.25 180 top
R7  16.15,14 180 bottom
R8  16.55,21.65 180 bottom
R9  13.7,11.75 180 bottom
R14  30.6,9.53 0 top
R15  20.85,6.34 270 top
R16  2.3,3.86 0 bottom
R17  30.86,14.02 0 top
R18  26.3,17.55 0 top
R19  33.85,6.59 270 top
R20  21.3,17.55 180 top
R23  27.13,6.34 90 top
R24  22.93,6.34 270 top
R40  11.4,13.5 0 top
R41  10.6,8.38 270 top
R42  11.76,19.8 0 top
R43  11.76,21.85 0 top
R44  7.97,14.3 270 bottom
R45  11.8,5.03 180 bottom
R46  12.05,19.73 180 bottom
R47  12.05,23.85 180 bottom
RXD  30.38,22.5 0 bottom
TVS3  30.5,6.53 180 top
TVS7  11.82,16.91 180 top
TVS8  11.83,16.89 0 bottom
TXD  30.35,24 0 bottom
U1  24.5,20.5 180 top
X3  2.55,14.9 270 top

### Tracks (layer width: path | path; a pad name or v marks a point on that pad's centre or on a via)
+3V3  (via drill 0.25, 0.3)
  Top 0.2: TVS3.5 29.53,6.53 30.64,5.43 30.64,3 31.2,2.44 32.56,2.44 JP7.1
  Top 0.254: R1.2 27.1,13.65 26.6,13.15 IC2.8 IC2.7 | R14.2 31.66,9.64 v31.66,12.5 | JP5.1 32.56,19.35 JP1.2 | U1.4 23.55,18.3 v23.4,18.15 | R18.2 28.35,16.45 v28.35,15.95
  Top 0.305: R20.2 19.85,18.05 v19.05,18.05 | C15.1 21.55,19.8 v21.55,20.95 | v28.35,15.95 27.75,15.95 R1.2 | D41.3 15.35,7.45 v15.35,6.75 | D42.3 17.35,17.8 v17.35,16.85 | R15.2 | R15.2 v20.85,4.15 | IC2.3 18.51,10.62 C2.1 18.46,11.45 v19.34,12.31
  Top 0.406: C13.2 C1.2 29.8,15.95 v28.35,15.95
  Bottom 0.254: Q2.4 Q2.1 | IC1.8 24.83,11.62 24.26,11.05 22.26,11.05 21.73,10.52 C12.2 | IC1.44 28.48,16.08 v28.35,15.95 | X3.2 0.62,9.8 0.62,4.59 R16.2
  Bottom 0.305: Q2.4 30.85,9.52 C14.2 31.66,11.36 v31.66,12.5 | C12.2 21.33,9.67 20.63,8.97 20.63,6.8 C11.2 21.75,5.69 | v17.26,18.9 17.2,18.84 D39.3 | D40.3 15.05,8.7 v15.25,8.9
  Bottom 0.406: 21.75,5.69 v21.75,4.15 v20.85,4.15
  other vias: 31.69,11.65
  pour VCC (rank 3): 0,25 0,0 35,0 35,25
BUS_V
  Bottom 0.254: JP3.2 16.35,2.65 18.1,2.65 19.75,4.3 19.75,9.38 20.19,9.82 20.19,11.35 22.46,13.62 24.22,13.62 27.68,17.08 IC1.42
DBG_RXD
  Bottom 0.2: IC1.37 29.13,19.58 28.93,19.78 28.93,21.21 30.23,22.5 RXD.TP
DBG_TXD
  Bottom 0.2: IC1.36 28.33,21.78 30.35,23.8 TXD.TP
EIB_IN
  Bottom 0.254: IC1.9 24.33,11.73 24.1,11.5 21.67,11.5 20.69,10.53 20.69,9.7 20.19,9.2 20.19,3.95 JP3.3
EIB_OUT
  Bottom 0.254: IC1.17 19.98,16.08 18.64,14.73 18.64,13.17 17.78,12.31 17.78,9.89 16.53,8.65 16.53,4.57 13.26,1.3 JP3.1
GND  (via drill 0.25, 0.3)
  Top 0.254: v33.6,8.96 33.11,8.47 31.49,8.47 30.91,7.89 30.91,6.92 31.35,6.48 31.73,6.48 TVS3.2
  Top 0.305: v12.55,3.75 11.98,3.75 10.77,4.96 D32.2 | TVS7.2 12.36,16.91 v11.95,16.5 | D33.2 18.32,21.15 v19.1,21.15 | D31.2 15.53,10.25 v14.75,10.25 | D34.2 17.09,12.32 v16.6,12.32 | v23.65,2.95 24.97,4.27 C9.1 | IC2.4 19.14,9.35 C2.2 18.46,7.49 v18.5,7.45
  Top 0.406: C15.2 20.2,20.05 v20.2,21.05 | v9.2,20.95 9.2,20.6 C20.1 | C13.1 33.29,18.11 JP1.1 32.77,16.07 C1.1
  Bottom 0.254: IC1.41 28.56,17.58 v28.41,17.73 | Q2.2 29.43,6.87 29.43,8.95 28.43,9.95 C14.1 27.67,10.8 26.84,10.8 26.33,11.31 IC1.5 26.33,13.99 v26.3,14.02 | D35.2 10.02,14.15 10.97,14.15 11.65,14.83 11.65,16.2 v11.95,16.5 | GND.TP JP1.1
  Bottom 0.305: C12.1 23.63,5.87 C11.1 23.23,5.31 23.23,4.22 v23.21,4.2 | v11.98,17.45 11.98,17.35 12.44,16.89 TVS8.2 | v9.1,22.4 8.9,22.4 C21.1 | D36.2 10.26,22.4 v9.4,23.27 | D37.2 10.53,10.41 v10.7,10.58 | v19.05,6.34 19.05,5.69 D38.2
  other vias: 10.15,1.4 24.2,17.8 32.3,24.2
  pour GND (rank 4): 35,0 0,0 0,25 35,25
  pour Top: 0,25 0,0 35,0 35,25
  pour Bottom (rank 3): 0,25 0,0 35,0 35,25
  pour Bottom: 26.9,11.15 31.4,11.15 31.85,10.7 31.85,9.35 32.25,8.95 32.25,5.15 31.75,4.65 27.25,4.65 26.7,5.2 26.7,6.3 26.35,6.65 23.25,6.65 22.85,7.05 22.85,10.45 23.15,10.75 26.5,10.75
IN1
  Bottom 0.406: FB10.2 5.92,11.72 X3.3
IN2
  Bottom 0.406: FB9.2 5.54,9.15 4.24,10.45 3.31,10.45 1.28,12.48 X3.4
IN3
  Bottom 0.406: FB8.2 3.82,15.06 X3.5
IN4
  Bottom 0.406: FB7.2 2.55,22.88 2.55,16.8 X3.6
IN5
  Top 0.406: X3.7 5.07,15.56 5.07,12.51 5.88,11.7 FB3.2
IN6
  Top 0.406: X3.9 3.82,18.3 5.6,16.52 5.63,16.52 FB5.2
IN7
  Top 0.406: FB4.2 5.14,9.11 5.14,9.71 4.38,10.46 3.3,10.46 2.55,11.21 2.55,17.11 1.58,18.07 X3.8
IN8
  Top 0.406: X3.10 4.46,23.8 FB6.2
IO1
  Bottom 0.254: IC1.18 19.91,16.59 18.23,14.9 18.23,13.33 17.82,12.93 15.73,12.93 14.65,11.85 R9.2
IO1R
  Bottom 0.254: R44.2 8.18,13.35 9.55,11.97 D37.1 10.75,11.75 R9.1 12.85,11.65 D40.2
IO2
  Bottom 0.254: IC1.14 20.23,14.58 19.1,13.45 19.1,13.05 18.3,12.25 18.3,11.25 R3.2
IO2R
  Bottom 0.254: R45.2 12.79,5.07 D38.1 16.1,5.94 16.1,8.9 17.2,10 17.2,10.45 R3.1
  Bottom 0.305: D40.1 12.85,5.12 R45.2
IO3
  Bottom 0.254: R7.2 17.1,14.37 20.31,17.58 IC1.20
IO3R
  Bottom 0.254: D35.1 15.15,14.05 R7.1 15.2,16.75 D39.1 15,17.25 14.02,18.23 14.02,18.71 R46.2
IO4
  Bottom 0.254: R8.2 17.4,21.65 17.1,21.35 17.1,20.05 17.45,19.7 19.15,19.7 19.77,19.08 IC1.23
IO4R
  Bottom 0.254: R47.2 13.46,23.39 D36.1 13.62,21.65 R8.1
  Bottom 0.305: D39.2 15,21.05 R8.1
IO5  (via drill 0.3)
  Top 0.254: v18.6,16.75 18.68,16.84 19.08,16.44 19.08,15.42 R6.2
  Bottom 0.254: IC1.21 20.03,18.08 18.7,16.75 v18.6,16.75
IO5R
  Top 0.254: R40.2 12.68,13.17 D31.1 12.68,8.87 D41.1 13.89,9.84 13.89,10.47 15.79,12.37 15.79,12.76 16.87,13.84 19.64,13.84 21.05,15.25 R6.1
IO6  (via drill 0.25)
  Top 0.254: v17.65,6.6 18.15,6.1 18.15,4.9 R2.2
  Bottom 0.254: IC1.13 21.28,13.23 19.73,11.68 19.73,9.98 19.42,9.67 18.22,9.67 17.65,9.11 v17.65,6.6
IO6R
  Top 0.254: R41.2 11.12,6.9 12.75,6.9 D41.2 12.88,6.85 13.97,5.76 D32.1 15.99,5.16 R2.1
IO7  (via drill 0.3)
  Top 0.254: v18.35,18.89 18.35,17.35 18,17 18,16.1 R4.2
  Bottom 0.254: IC1.22 19.42,18.58 19.11,18.89 v18.35,18.89
IO7R
  Top 0.254: R42.2 14.05,18.46 14.05,17.4 14.5,16.95 D42.2 15.15,16.85 R4.1 14.85,14.85 14.85,13.28 D34.1
IO8  (via drill 0.3)
  Top 0.254: R5.2 12.96,23.9 14.6,22.26 20.34,22.26 20.85,21.75 v20.85,21.65
  Bottom 0.254: IC1.24 20.85,20.01 v20.85,21.65
IO8R
  Top 0.254: D42.1 15.05,20.57 D33.1 14.43,20.82 13.4,21.85 R43.2 10.81,23.75 R5.1
ISP_EN  (via drill 0.25)
  Top 0.2: v29.84,12.1 29.84,11.65 27.72,9.53 27.72,8.79 27.13,8.2 23.84,8.2 R24.1 R15.1
  Bottom 0.2: IC1.4 26.83,13.58 27.35,14.1 28.59,14.1 29.84,12.85 v29.84,12.1
ISP_RXD
  Bottom 0.2: JP7.3 32.64,2.44 32.64,4.3 32.86,4.53 32.86,9.4 32.65,9.62 32.65,13.05 30.62,15.08 IC1.46
ISP_TXD
  Bottom 0.2: JP7.5 30.6,2.4 30.6,3.77 31.23,4.4 32.21,4.4 32.5,4.69 32.5,9.27 32.29,9.47 32.29,12.91 30.62,14.58 IC1.47
MISO1  (via drill 0.3)
  Top 0.254: IC2.2 22.25,11.88 22.95,12.59 v22.95,14.27
  Bottom 0.254: v22.95,14.27 23,14.27 23.7,14.97 24.14,14.97 25.59,16.42 25.59,17.6 24.64,18.55 24.61,18.55 23.33,19.83 IC1.26
MOSI1  (via drill 0.3)
  Top 0.254: IC2.5 25.2,9.35 23.94,10.6 v23.94,14.3
  Bottom 0.254: v23.94,14.3 24.2,14.3 26.05,16.15 26.05,17.7 26.44,18.09 27.37,18.09 28.36,19.08 IC1.38
N$1
  Top 0.254: F19.1 6.34,17.77 8.4,15.72 FB5.1
N$2
  Top 0.254: FB6.1 7.72,23.7 F20.1
N$3
  Top 0.254: FB4.1 8.4,7.85 6.51,9.74 F18.1
N$4
  Top 0.254: FB3.1 8.4,11.77 6.41,13.77 F17.1
N$5
  Bottom 0.254: F24.1 3.88,23.55 FB7.1
N$6
  Bottom 0.254: F23.1 5.96,19.3 7.9,17.35 FB8.1
N$7
  Bottom 0.254: FB10.1 8.25,11.25 6.25,13.25 F21.1
N$8
  Bottom 0.254: F22.1 8.25,7.81 FB9.1
N$9
  Bottom 0.254: TVS8.3 12.62,15.94 12.12,15.45 12.12,13.36 12.61,12.88 13.42,12.88 13.68,12.62 13.68,10.62 13.85,10.45 13.85,8.22 13.48,7.86
  Bottom 0.305: 13.48,7.86 12.12,7.86 11.48,7.21 F22.2 10.85,7.01 R45.1
N$10
  Bottom 0.254: Q2.3 28.35,8.04 28.15,7.83 C8.2
N$11
  Top 0.254: TVS7.1 12.99,15.86 11.99,15.86 11.38,15.24 11.38,10.1 R41.1 10.19,9.74 F18.2
N$12
  Top 0.254: F17.2 8.76,13.5 R40.1 10.1,13.5 10.1,15.71 10.35,15.96 TVS7.6
N$13
  Bottom 0.254: F23.2 6.97,20.38 8.8,20.38 9.45,19.73 R46.1 10.61,19.23 10.61,17.89 TVS8.6
N$15
  Top 0.254: F19.2 7.5,18.78 9.28,18.78 10.2,17.86 TVS7.4 10.79,17.86 10.99,18.06 10.99,19.73 10.93,19.8 R42.1
N$16
  Bottom 0.254: F24.2 8.39,23.95 11,23.95 R47.1 12.07,22.88 12.07,18.72 12.96,17.84 TVS8.1
N$17
  Top 0.254: F20.2 8.12,21.7 10.66,21.7 R43.1 10.9,21.85 11.75,21 11.75,18.93 11.96,18.72 12.88,18.72 13.1,18.51 TVS7.3
N$18
  Bottom 0.254: TVS8.4 10.36,16.14 9.05,16.14 8.16,15.25 R44.1 6.21,15.25 F21.2
N$41
  Bottom 0.2: LED1.A 3.81,3.86 R16.1
N$43
  Top 0.254: C20.2 9.29,16.91 TVS7.5
N$48
  Bottom 0.254: TVS8.5 10.11,16.89 9.65,17.34 9.65,18.7 8.9,19.45 C21.2
NOGND
  cutout Top: 27.05,0 27.05,4.25 33.15,4.25 33.15,0
  cutout GND: 27.05,0 27.05,4.25 33.15,4.25 33.15,0
  cutout VCC: 27.05,0 27.05,4.25 33.15,4.25 33.15,0
  cutout VCC: 27.05,0 27.05,4.25 33.15,4.25 33.15,0
  cutout GND: 27.05,0 27.05,4.25 33.15,4.25 33.15,0
  cutout Bottom: 27.05,0 27.05,4.25 33.15,4.25 33.15,0
  cutout VCC: 27.05,0 27.05,4.25 33.15,4.25 33.15,0
  pour Bottom (isolate 0.254, rank 2): 26.9,11.15 31.4,11.15 31.85,10.7 31.85,9.35 32.25,8.95 32.25,5.15 31.75,4.65 27.25,4.65 26.7,5.2 26.7,6.3 26.35,6.65 23.25,6.65 22.85,7.05 22.85,10.45 23.15,10.75 26.5,10.75
PROG  (via drill 0.2)
  Top 0.2: v29.01,11.64 28.56,11.64 27.31,10.39 27.31,8.99 26.96,8.64 20.42,8.64 19.66,7.88 19.66,4.46 18.35,3.15 9.72,3.15 JP8.1
  Bottom 0.2: IC1.2 27.83,11.67 28,11.5 28.8,11.5 28.94,11.64 v29.01,11.64 | LED1.C 8.8,2.23 JP8.1
RESET  (via drill 0.25)
  Top 0.2: v29.1,12.7 30.1,12.7 30.45,12.35 30.45,11.03 29.65,10.22 R14.1 29.65,9.24 27.7,7.29 R23.2 C9.2
  Bottom 0.2: v29.1,12.7 29.1,13.05 28.45,13.7 27.6,13.7 27.33,13.43 IC1.3
SCK1  (via drill 0.3)
  Top 0.254: IC2.6 27,10.62 28.39,12 v28.39,15.12
  Bottom 0.254: IC1.43 27.88,16.58 27.57,16.27 27.57,15.79 28.23,15.12 v28.39,15.12
SCL  (via drill 0.3)
  Top 0.254: v23.63,15.67 23.63,16.78 24,17.15 24.95,17.15 R18.1 25.35,18.07 24.92,18.5 24.92,19.9 25.45,20.43 U1.1 25.03,22.22 25.03,22.5 24.88,22.65 24.6,22.65 23.55,23.7 JP5.3
  VCC 0.2: JP5.3 24.88,21.95 32.65,21.95 JP1.4
  Bottom 0.254: IC1.15 23.04,15.08 v23.63,15.67
SDA  (via drill 0.3)
  Top 0.254: v22.75,16.3 22.75,17.05 R20.1 22.82,18.12 22.82,21.22 23.4,21.8 U1.3 21.55,21.8 20.59,22.76 JP5.4
  VCC 0.2: JP5.4 22.71,21.57 33.83,21.57 JP1.3
  Bottom 0.254: v22.75,16.3 22.75,15.85 22.48,15.58 IC1.16
SSEL1  (via drill 0.3)
  Top 0.254: IC2.1 21.1,13.15 21.35,13.4 21.35,13.65 22.7,15 24.9,15 R1.1 25.2,15.55 v24.25,16.5
  Bottom 0.254: v24.25,16.5 23.67,17.08 IC1.19
SWCLK  (via drill 0.3)
  Top 0.2: R17.1 29.97,14.02 30.82,14.87 30.82,19.05 30.37,19.5 27.45,19.5 27.3,19.35 v27.3,18.95
  Bottom 0.2: IC1.29 24.83,20.37 26.25,18.95 v27.3,18.95
SWD_ISP_EN
  Top 0.2: JP7.7 26.66,2.34 23.26,2.34 22.43,3.17 22.43,4.89 R24.2 23.05,5.39 24.01,6.35 28.14,6.35 28.14,6.75 28.87,7.48 TVS3.4
SWD_RESET
  Top 0.2: JP7.10 25.6,3.86 R23.1 27.32,5.58 TVS3.6
SWD_SWCLK
  Top 0.2: R17.2 30.92,13.12 30.92,10.82 30.6,10.5 30.6,8.5 30.25,8.15 30.25,6.7 31.37,5.58 TVS3.1 31.77,3.58 JP7.4
SWD_SWDIO
  Top 0.2: TVS3.3 32.1,7.48 33.85,5.73 R19.2 33.85,3.65 JP7.2
SWDIO  (via drill 0.3)
  Top 0.2: v34.2,15.65 34.42,15.43 34.42,8.01 33.95,7.54 R19.1
  Bottom 0.254: v34.2,15.65 31.27,18.58 IC1.39
XTALIN
  Bottom 0.2: C8.1 25.83,9.95 IC1.6
  Bottom 0.305: C7.2 C8.1

### Text on the board
tDocu: GND | SDA | SCL | +3V3 | www.selfbus.org | selfbus.org | IO module fused 8x / v1.0.0 beta2 | GND | EIB OUT | BUS-V | EIB IN | +3V3
bDocu: (beta) | www.selfbus.org | 26.04.2022 | IO module 8x fused in-wall 35x25 v1.0.0 | EIB OUT | BUS-V | EIB IN | +3V3 | GND